# Altium project LF-timegate-REVB.PrjPcb (part 2 of 2)

## Sheet Autoreset.SchDoc
size A4; SheetNumber: 10; SheetTotal: 12
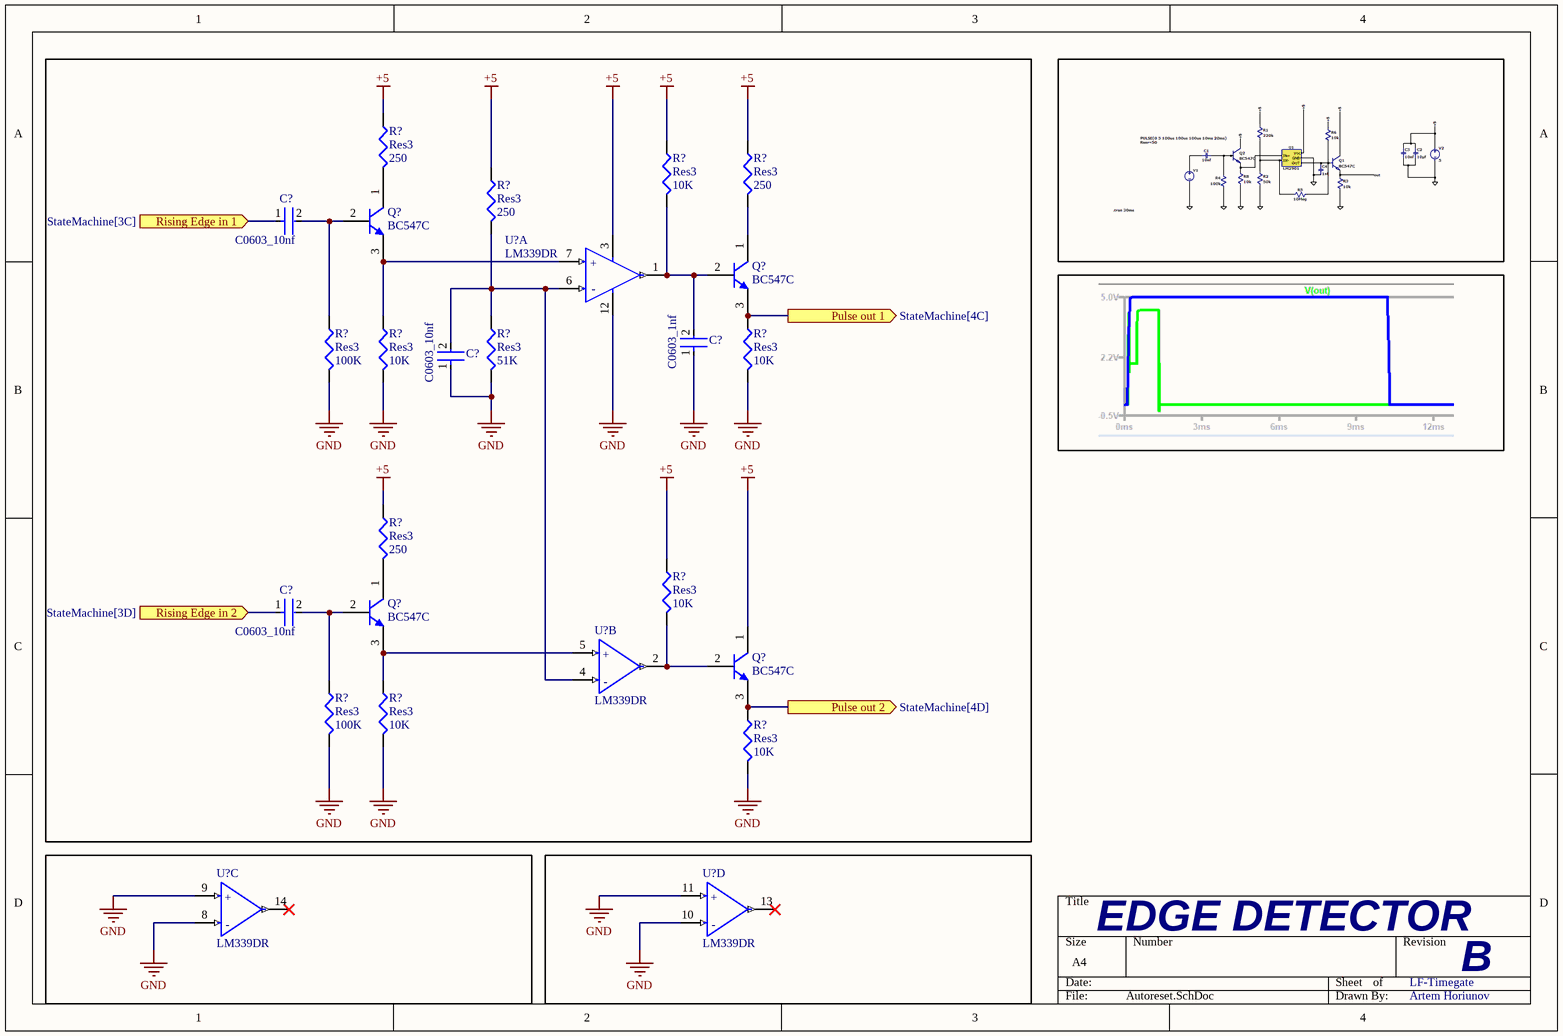
[diagram p10: Autoreset.SchDoc]

### Parts
(Parts that share a designator on the sheet are numbered #1, #2 ... from top to bottom, then left to right.)
C?#3  C0603_10nf  [FP-C0603C-CF-MFG]
C?#4  C0603_1nf  [FP-C0603C-CF-MFG]
C?#5  C0603_10nf  [FP-C0603C-CF-MFG]
C?#6  C0603_10nf  [FP-C0603C-CF-MFG]
Q?#3  BC547C  [ONSC-TO-92-3-29-11]
Q?#4  BC547C  [ONSC-TO-92-3-29-11]
Q?#5  BC547C  [ONSC-TO-92-3-29-11]
Q?#6  BC547C  [ONSC-TO-92-3-29-11]
R?#9  Res3  value 250  [J1-0603]
R?#10  Res3  value 10K  [J1-0603]
R?#11  Res3  value 250  [J1-0603]
R?#12  Res3  value 250  [J1-0603]
R?#13  Res3  value 100K  [J1-0603]
R?#14  Res3  value 10K  [J1-0603]
R?#15  Res3  value 51K  [J1-0603]
R?#16  Res3  value 10K  [J1-0603]
R?#17  Res3  value 250  [J1-0603]
R?#18  Res3  value 10K  [J1-0603]
R?#19  Res3  value 100K  [J1-0603]
R?#20  Res3  value 10K  [J1-0603]
R?#21  Res3  value 10K  [J1-0603]
U?#4  LM339DR  [FP-D0014A-MFG]  (part A of 4)
U?#5  LM339DR  [FP-D0014A-MFG]  (part B of 4)
U?#6  LM339DR  [FP-D0014A-MFG]  (part C of 4)
U?#7  LM339DR  [FP-D0014A-MFG]  (part D of 4)

### Ports
Pulse out 1 (out, see StateMachine[4C]), Pulse out 2 (out, see StateMachine[4D]), Rising Edge in 1 (in, see StateMachine[3C]), Rising Edge in 2 (in, see StateMachine[3D])

### Nets
+5: Q?#6.1(C) R?#9.1 R?#10.1 R?#11.1 R?#12.1 R?#17.1 R?#18.1 U?#4.3(VCC)
GND: C?#4.1 C?#5.1 R?#13.2 R?#14.2 R?#15.2 R?#16.2 R?#19.2 R?#20.2 R?#21.2 U?#4.12(GND) U?#6.8(3IN-) U?#6.9(3IN+) U?#7.10(4IN-) U?#7.11(4IN+)  [project net R-SEG]
Qn: C?#3.1 ; port Rising Edge in 1
NetC?#3_2: C?#3.2 Q?#3.2(B) R?#13.1
NetC?#4_2: C?#4.2 Q?#4.2(B) R?#10.2 U?#4.1(1OUT)
NetC?#5_2: C?#5.2 R?#12.2 R?#15.1 U?#4.6(1IN-) U?#5.4(2IN-)
NetC?#6_1: C?#6.1 ; port Rising Edge in 2
NetC?#6_2: C?#6.2 Q?#5.2(B) R?#19.1
NetPrelacznik_trybu?_2: Q?#6.3(E) R?#21.1 ; port Pulse out 2
NetPrelacznik_trybu?_3: Q?#4.3(E) R?#16.1 ; port Pulse out 1
NetQ?#3_1: Q?#3.1(C) R?#9.2
NetQ?#3_3: Q?#3.3(E) R?#14.1 U?#4.7(1IN+)
NetQ?#4_1: Q?#4.1(C) R?#11.2
NetQ?#5_1: Q?#5.1(C) R?#17.2
NetQ?#5_3: Q?#5.3(E) R?#20.1 U?#5.5(2IN+)
NetQ?#6_2: Q?#6.2(B) R?#18.2 U?#5.2(2OUT)

Not connected (* = marked no-connect by the designer): U?#6 14(OUT3)*; U?#7 13(OUT4)*

### Notes on the sheet
- EDGE DETECTOR
- LF-Timegate
- B
- Artem Horiunov
- (in symbol CMP-04896-000028-1, part A) +; -
- (in symbol CMP-04896-000028-1, part B) +; -
- (in symbol CMP-04896-000028-1, part C) +; -
- (in symbol CMP-04896-000028-1, part D) +; -

### Library data of the parts
C?#3-C?#6 = CMP-1035-00914-3: CAP CER 30PF 50V 5% NP0 0603; Manufacturer Part Number: C0603C300J5GACTU; Manufacturer: KEMET; Automotive Grade: Grade 1; Temperature Coefficient: 30ppm/°C; Material: Ceramic; Temperature Characteristic: C0G; Tolerance: 0.05; ComponentLink2URL: https://api.kemet.com/component-edge/download/datasheet/C0603C100J5GACAUTO.pdf; Automotive: Yes; Device Class L2: Capacitors; Device Class L1: Passive Components; Device Class L3: Ceramic Capacitors; RoHS: TRUE; Octopart: https://octopart.com/c0603c300j5gactu-kemet-199455; Lead Free: Yes; Value: 30 pF; Temperature Range High: +125°C; Category: Cap; Temperature: -55°C to +125°C; Package: C0603C-CF; Capacitance: 30 pF; Digikey Description: CAP CER 30PF 50V 5% NP0 0603; Height: 0.87mm; ComponentLink2Description: Datasheet; Temperature Range Low: -55°C; Mouser Description: Multilayer Ceramic Capacitors MLCC - SMD/SMT 50volts 30pF C0G 5%; Voltage Rating: 50 V
Q?#3-Q?#6 = CMP-1048-01437-1: Amplifier Transistor, NPN Silicon, 3-Pin TO-92, Bulk Box; Manufacturer: On Semiconductor; IC Continuous (A): 0.1; fT Min (MHz): 150; Mounting Technology: Through Hole; ComponentLink1URL: http://www.onsemi.com/; ComponentLink1Description: Manufacturer URL; ComponentLink3URL: http://www.onsemi.cn/pub_link/Collateral/2N6426-D.PDF; DatasheetVersion: Rev. 7; PackageVersion: Rev. AM; Packing: Bulk Box; RoHS: FALSE; Polarity: NPN; PartNumber: BC547C; ComponentLink2URL: http://www.onsemi.com/pub_link/Collateral/BC546-D.PDF; ComponentLink3Description: Package Specification; PackageDescription: 3-Pin Transistor Outline, Body 4.825 x 3.685 mm, Pitch 1.27 mm; PackageReference: TO-92-3-29-11_AM_SL; ComponentLink2Description: Datasheet
R?#9-R?#21 = Res3: Resistor; Published: 8-Jun-2000; LatestRevisionDate: 29-May-2009; LatestRevisionNote: IPC-7351 Footprint Added.; PackageReference: J1-0603; Publisher: Altium Limited; PackageDescription: Chip Resistor
U?#4-U?#7 = CMP-04896-000028-1: IC QUAD DIFF COMP 14-SOIC; Manufacturer: Texas Instruments; Nominal Supply Current: 0.8mA; Min Dual Supply Voltage: 1V; Number Of Channels: 4; Input Offset Voltage: 2mV; Max Junction Temp: +70°C; Min Supply Voltage: 2V; Response Time: 1.3us; Max Dual Supply Voltage: 18V; Max Supply Voltage: 30V; Standoff Height: 0.1mm; Input Bias Current: -0.025uA; Output Current Per Channel: 6mA; Category: IC; Octopart: https://octopart.com/lm339dr-texas+instruments-45532; Automotive: No; Temperature: 0°C to +70°C; Ipc Land Pattern Name: SOIC127P600X175-14; Temperature Range Low: 0°C; Mouser Description: Analog Comparators Quad Differential; Lead Free: Yes; Digikey Description: IC QUAD DIFF COMP 14-SOIC; ComponentLink2URL: http://www.ti.com/lit/ds/symlink/lm339.pdf; Device Class L3: Comparators; Manufacturer Part Number: LM339DR; Temperature Range High: +70°C; Device Class L2: Linear ICs; Height: 1.75mm; Device Class L1: Integrated Circuits (ICs); Package: D0014A; RoHS: TRUE; ComponentLink2Description: Datasheet

## Sheet UserPanel.SchDoc
size A4; SheetNumber: 11; SheetTotal: 12
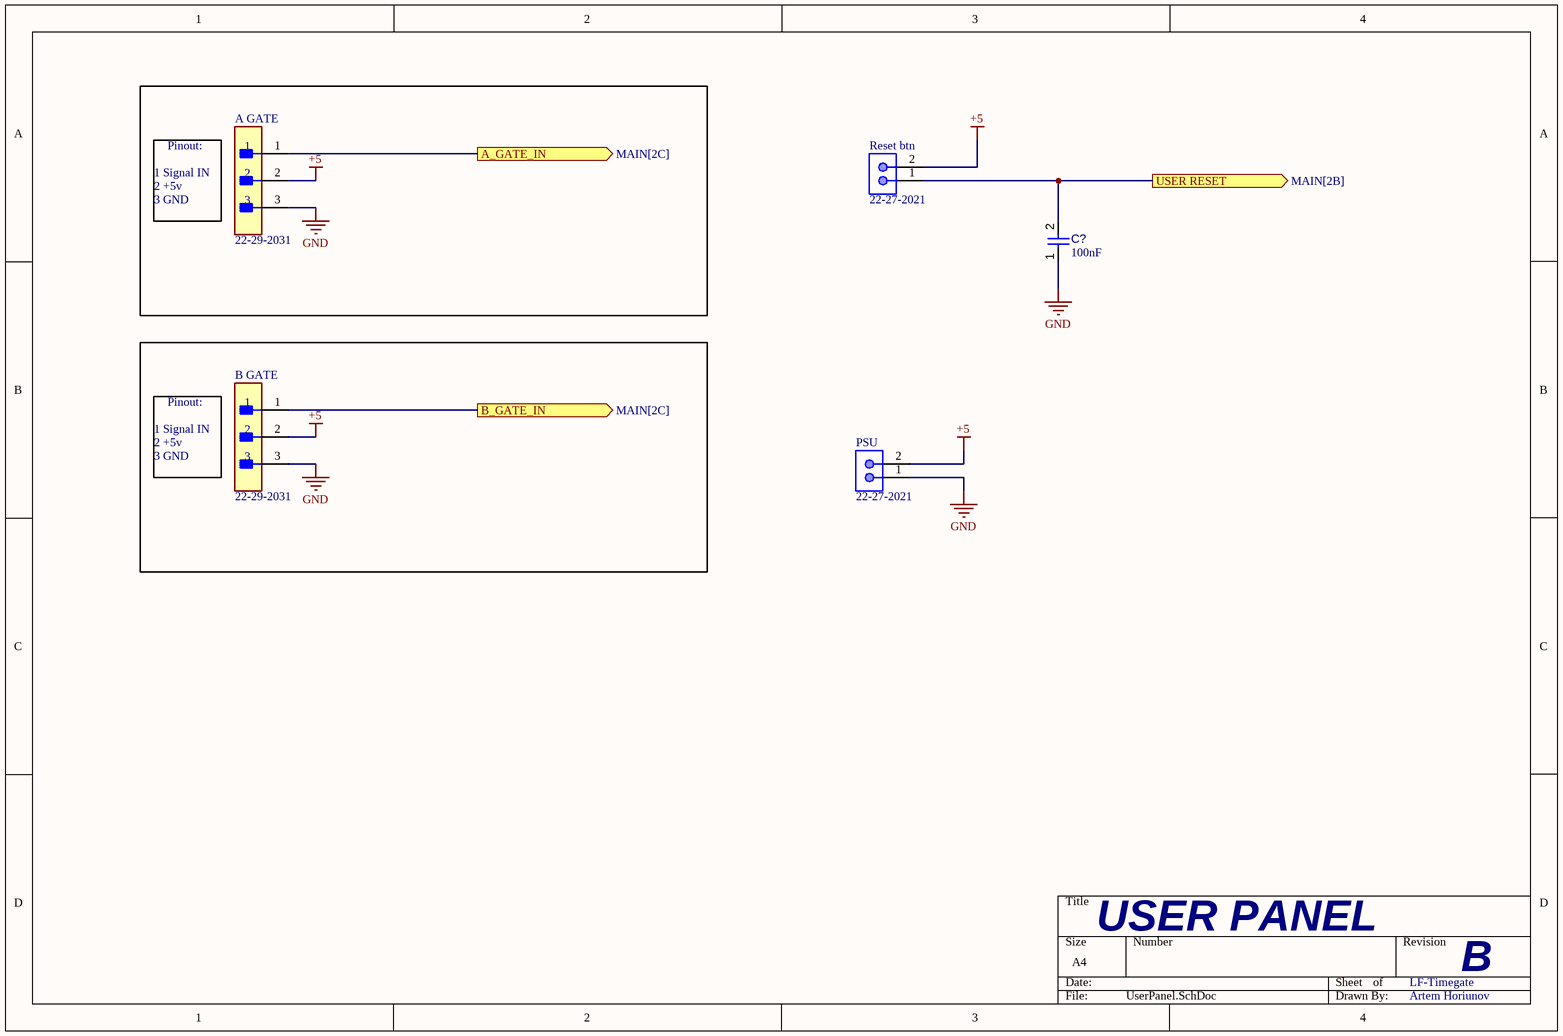
[diagram p11: UserPanel.SchDoc]

### Parts
(Parts that share a designator on the sheet are numbered #1, #2 ... from top to bottom, then left to right.)
A_GATE  22-29-2031  [FP-22-29-2031-MFG]
B_GATE  22-29-2031  [FP-22-29-2031-MFG]
C?#7  value 100nF  [CAPC2013X95X50LL10T25]  (hidden comment: Capacitor 100 nF +/-10% 50 V 0805)
PSU  22-27-2021  [MOLX-22-27-2021_V]
Reset_btn  22-27-2021  [MOLX-22-27-2021_V]

### Ports
A_GATE_IN (out, see MAIN[2C]), B_GATE_IN (out, see MAIN[2C]), USER RESET (out, see MAIN[2B])

### Nets
+5: A_GATE.2 B_GATE.2 PSU.2 Reset_btn.2
GND: A_GATE.3 B_GATE.3 C?#7.1 PSU.1  [project net R-SEG]
CNT_RESET1: C?#7.2 Reset_btn.1 ; port USER RESET
NetA_GATE_1: A_GATE.1 ; port A_GATE_IN
NetB_GATE_1: B_GATE.1 ; port B_GATE_IN

### Notes on the sheet
- (near A_GATE) 1 Signal IN
- (near A_GATE) Pinout:
- 2 +5v
- 3 GND
- (near B_GATE) 1 Signal IN
- (near B_GATE) Pinout:
- USER PANEL
- LF-Timegate
- B
- Artem Horiunov

### Library data of the parts
A_GATE B_GATE = CMP-04776-000327-1: CONN HEADER VERT 3POS 2.54MM; Contact Resistance: 10mR; Number of Positions: 3; Voltage Rating: 250V; Gender: Male; Connector Type: Male Pin; Current Rating: 4A; Packaging: Bulk; Housing Material: Nylon; Min Operating Temperature: 0°C; Color: Natural; RoHS Compliant: Yes; Housing Color: White; Number of Rows: 1; Pitch: 2.54mm; Mount: Through Hole; Fastening Type: Friction; Length: 7.62mm; Depth: 5.8mm; Contact Material: Brass; Max Operating Temperature: 75°C; Number of Contacts: 3; Contact Type: Male Pin; Working Voltage: 250V; Orientation: Straight; Lead Pitch: 2.54mm; Radiation Hardening: No; Termination: Solder; Contact Plating: Gold; Contact Mating Length: 0.295inch; Series: KK® 6410
C?#7 = CMP-001-00018-6: Chip Capacitor, 100 nF, +/- 10%, 50 V, 0805 (2012 Metric); Capacitor Type: Ceramic; Voltage Rating: 50V; Pins: 2; Max Operating Temperature: 125°C; Min Operating Temperature: -55°C; Mounting Technology: SM; Case/Package: 0805; RoHS Compliant: True; Tolerance: 10%
PSU Reset_btn = CMP-2000-05537-1: Male Header, Pitch 2.54 mm, 1 x 2 Position, Height 11.7 mm, Tail Length 3.56 mm, 0 to 75 degC, RoHS, Bulk; Manufacturer: Molex; PartNumber: 0022272021; Current rating: 4A; Package Version: Rev. BC, 02/2012; Voltage rating: 250V; No. of Positions: 2; Pitch: 2.54mm; No. of Rows: 1; Orientation: Vertical; Operating temperature: 0°Cto+75°C; Manufacturer URL: http://www.molex.com/; Mounting Technology: ThroughHole; Housing material: Nylon(UL94V-0); Package Description: 2-Leads Header, Body 5.08 x 5.8 mm, Pitch 2.54 mm; Voltage - Max: 250V; Datasheet URL: http://www.molex.com/pdm_docs/sd/022272021_sd.pdf; Package Reference: 22-27-2021; Contact material: Tinplatedbrass; Current - Max: 4A; Datasheet Version: Rev. F, 06/2009

## Nets that join several sheets
+5: ClockSystem (5 pins), CNT_BLOCK_1/CNT1 (7 pins), CNT_BLOCK_1/CNT2 (7 pins), CNT_BLOCK_1/CNT3 (5 pins), CNT_BLOCK_1/CNT3/DISP? (DISP?_CNT_BLOCK_1_CNT3_DISP?.1 DISP?_CNT_BLOCK_1_CNT3_DISP?.5), CounterS (C?#1.2 U?#1.16 U?#2.16), CNT_BLOCK_2/CNT4 (7 pins), CNT_BLOCK_2/CNT5 (5 pins), CNT_BLOCK_2/CNT5/DISP? (DISP?_CNT_BLOCK_2_CNT5_DISP?.1 DISP?_CNT_BLOCK_2_CNT5_DISP?.5), CNT_BLOCK_3/CNT1 (7 pins), StateMachine (C?#2.2 U?#3.16), SR (R?#3.1 R?#4.1), Autoreset (8 pins), UserPanel (A_GATE.2 B_GATE.2 PSU.2 Reset_btn.2)
R-SEG: ClockSystem (6 pins), CNT_BLOCK_1/CNT1 (6 pins), CNT_BLOCK_1/CNT2 (6 pins), CNT_BLOCK_1/CNT3 (7 pins), CounterS (?.2 C?#1.1 U?#2.8), CNT_BLOCK_2/CNT4 (7 pins), CNT_BLOCK_2/CNT5 (7 pins), CNT_BLOCK_3/CNT1 (7 pins), StateMachine (C?#2.1 R?#1.2 R?#2.2 U?#3.8), SR (Q?#1.3 Q?#2.3), Autoreset (14 pins), UserPanel (A_GATE.3 B_GATE.3 C?#7.1 PSU.1)
0.1Hz: CounterS (CNT_RST_?#2.1 CNT_RST_?#4.1 U?#1.14 U?#2.14), CNT_BLOCK_2/CNT4 (U?_CNT4#1.5 U?_CNT4#3.5), CNT_BLOCK_2/CNT5 (CNT_CLOCK?_CNT5.1 U?_CNT5#1.1 U?_CNT5#3.1)
1Hz: CNT_BLOCK_1/CNT3 (U?_CNT3#1.5 U?_CNT3#3.5), CounterS (CNT_RST_?#1.1), CNT_BLOCK_2/CNT4 (CNT_CLOCK?_CNT4.1 U?_CNT4#1.1 U?_CNT4#3.1)
1KHz: ClockSystem (1KHZ.1 U1.1), CNT_BLOCK_1/CNT1 (CNT_CLOCK?_CNT_BLOCK_1_CNT1.1 U?_CNT_BLOCK_1_CNT1#1.1 U?_CNT_BLOCK_1_CNT1#3.1)
1Min: CounterS (CNT_RST_?#3.1), CNT_BLOCK_2/CNT5 (U?_CNT5#1.5 U?_CNT5#3.5), CNT_BLOCK_3/CNT1 (CNT_CLOCK?_CNT_BLOCK_3_CNT1.1 U?_CNT_BLOCK_3_CNT1#1.1 U?_CNT_BLOCK_3_CNT1#3.1)
10Hz: CNT_BLOCK_1/CNT2 (U?_CNT2#1.5 U?_CNT2#3.5), CNT_BLOCK_1/CNT3 (CNT_CLOCK?_CNT3.1 U?_CNT3#1.1 U?_CNT3#3.1)
60Sec_pulse: CounterS (D?#2.1 U?#2.5), CNT_BLOCK_2/CNT5 (CNT_RST_?_CNT5#3.1 D?_CNT5#2.2)
100Hz: CNT_BLOCK_1/CNT1 (U?_CNT_BLOCK_1_CNT1#1.5 U?_CNT_BLOCK_1_CNT1#3.5), CNT_BLOCK_1/CNT2 (CNT_CLOCK?_CNT2.1 U?_CNT2#1.1 U?_CNT2#3.1)
A: CNT_BLOCK_1/CNT3 (R?_CNT3#5.2), CNT_BLOCK_1/CNT3/DISP? (DISP?_CNT_BLOCK_1_CNT3_DISP?.7)
A: CNT_BLOCK_2/CNT5 (R?_CNT5#5.2), CNT_BLOCK_2/CNT5/DISP? (DISP?_CNT_BLOCK_2_CNT5_DISP?.7)
A-SEGO_CNT3: CNT_BLOCK_1/CNT3 (R?_CNT3#2.2), CNT_BLOCK_1/CNT3/DISP? (DISP?_CNT_BLOCK_1_CNT3_DISP?.3)
A-SEGO_CNT5: CNT_BLOCK_2/CNT5 (R?_CNT5#2.2), CNT_BLOCK_2/CNT5/DISP? (DISP?_CNT_BLOCK_2_CNT5_DISP?.3)
ATUORESET: CNT_BLOCK_1/CNT1 (CNT_RST_?_CNT_BLOCK_1_CNT1#1.1 D?_CNT_BLOCK_1_CNT1.2), CNT_BLOCK_1/CNT2 (CNT_RST_?_CNT2#1.1 D?_CNT2.2), CNT_BLOCK_1/CNT3 (CNT_RST_?_CNT3#1.1 D?_CNT3#1.2), CounterS (D?#1.1), CNT_BLOCK_2/CNT4 (CNT_RST_?_CNT4#1.1 D?_CNT4.2), CNT_BLOCK_3/CNT1 (CNT_RST_?_CNT_BLOCK_3_CNT1#1.1 D?_CNT_BLOCK_3_CNT1.2), StateMachine (Prelacznik_trybu?.1)
B: CNT_BLOCK_1/CNT3 (R?_CNT3#6.2), CNT_BLOCK_1/CNT3/DISP? (DISP?_CNT_BLOCK_1_CNT3_DISP?.6)
B: CNT_BLOCK_2/CNT5 (R?_CNT5#6.2), CNT_BLOCK_2/CNT5/DISP? (DISP?_CNT_BLOCK_2_CNT5_DISP?.6)
B-SEGO_CNT3: CNT_BLOCK_1/CNT3 (R?_CNT3#3.2), CNT_BLOCK_1/CNT3/DISP? (DISP?_CNT_BLOCK_1_CNT3_DISP?.2)
B-SEGO_CNT5: CNT_BLOCK_2/CNT5 (R?_CNT5#3.2), CNT_BLOCK_2/CNT5/DISP? (DISP?_CNT_BLOCK_2_CNT5_DISP?.2)
C: CNT_BLOCK_1/CNT3 (R?_CNT3#8.2), CNT_BLOCK_1/CNT3/DISP? (DISP?_CNT_BLOCK_1_CNT3_DISP?.4)
C: CNT_BLOCK_2/CNT5 (R?_CNT5#8.2), CNT_BLOCK_2/CNT5/DISP? (DISP?_CNT_BLOCK_2_CNT5_DISP?.4)
C-SEGO_CNT3: CNT_BLOCK_1/CNT3 (R?_CNT3#4.2), CNT_BLOCK_1/CNT3/DISP? (DISP?_CNT_BLOCK_1_CNT3_DISP?.9)
C-SEGO_CNT5: CNT_BLOCK_2/CNT5 (R?_CNT5#4.2), CNT_BLOCK_2/CNT5/DISP? (DISP?_CNT_BLOCK_2_CNT5_DISP?.9)
CNT_RESET1: CNT_BLOCK_1/CNT1 (CNT_RST_?_CNT_BLOCK_1_CNT1#2.1 D?_CNT_BLOCK_1_CNT1.1), CNT_BLOCK_1/CNT2 (CNT_RST_?_CNT2#2.1 D?_CNT2.1), CNT_BLOCK_1/CNT3 (CNT_RST_?_CNT3#2.1 D?_CNT3#1.1), CounterS (D?#1.2), CNT_BLOCK_2/CNT4 (CNT_RST_?_CNT4#2.1 D?_CNT4.1), CNT_BLOCK_2/CNT5 (CNT_RST_?_CNT5#1.1 CNT_RST_?_CNT5#2.1 D?_CNT5#1.1 D?_CNT5#1.2), CNT_BLOCK_3/CNT1 (CNT_RST_?_CNT_BLOCK_3_CNT1#2.1 D?_CNT_BLOCK_3_CNT1.1), StateMachine (D?#3.2 D?#5.2), UserPanel (C?#7.2 Reset_btn.1)
G: CNT_BLOCK_1/CNT3 (R?_CNT3#9.2), CNT_BLOCK_1/CNT3/DISP? (DISP?_CNT_BLOCK_1_CNT3_DISP?.10)
G: CNT_BLOCK_2/CNT5 (R?_CNT5#9.2), CNT_BLOCK_2/CNT5/DISP? (DISP?_CNT_BLOCK_2_CNT5_DISP?.10)
NetA_GATE_1: StateMachine (D?#4.1 U?#3.14), UserPanel (A_GATE.1)
NetB_GATE_1: StateMachine (D?#3.1), UserPanel (B_GATE.1)
NetC?#6_1: StateMachine (U?#3.2), Autoreset (C?#6.1)
NetD?#3_3: StateMachine (D?#3.3), SR (R?#7.1)
NetPrelacznik_trybu?_2: StateMachine (Prelacznik_trybu?.2), Autoreset (Q?#6.3 R?#21.1)
NetPrelacznik_trybu?_3: StateMachine (Prelacznik_trybu?.3), Autoreset (Q?#4.3 R?#16.1)
Q: StateMachine (Prelacznik_trybu?.6), SR (Q?#2.1 R?#4.2 R?#5.2)
Qn: SR (Q?#1.1 R?#3.2 R?#6.1), Autoreset (C?#3.1)
R: StateMachine (D?#4.3), SR (R?#8.1)
R-SEGO_CNT3: CNT_BLOCK_1/CNT3 (R?_CNT3#10.2), CNT_BLOCK_1/CNT3/DISP? (DISP?_CNT_BLOCK_1_CNT3_DISP?.8)
R-SEGO_CNT5: CNT_BLOCK_2/CNT5 (R?_CNT5#10.2), CNT_BLOCK_2/CNT5/DISP? (DISP?_CNT_BLOCK_2_CNT5_DISP?.8)
STOP_TIMER: ClockSystem (D1.2), StateMachine (Prelacznik_trybu?.4)